# EAGLE design power-bridge (EAGLE 9.5.1)
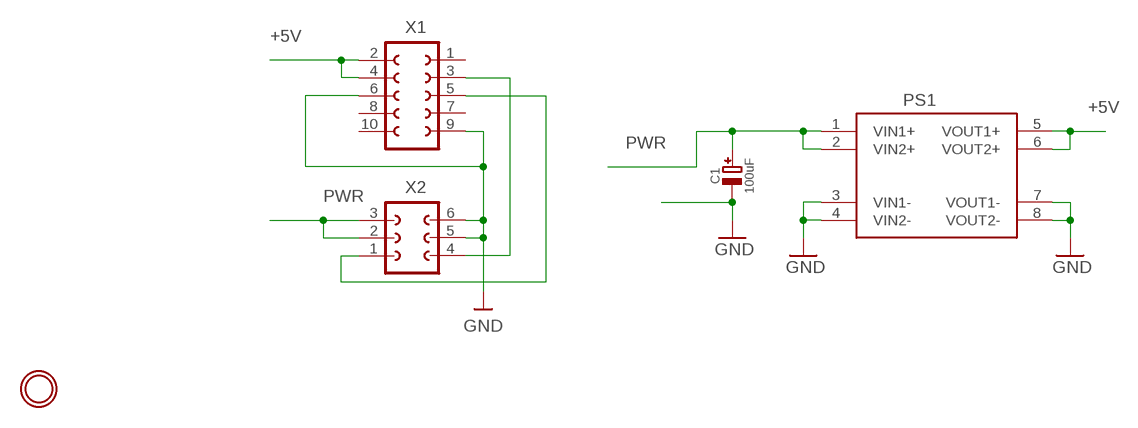
[diagram p0: schematic, sheet 1]

## Parts
C1  100uF  CAP_ELECTROLYTICPTH_3.5MMGRID_8MMDIA  [CELEC_3.5MM_8MM]
PS1  K8801MODULE  [K8801]
U$2  MOUNTINGHOLE2.7_THICK  [MOUNTINGHOLE_2.7_PLATED_THICK]
X1  CON-FE05-2  [FE05-2]
X2  CON-MA03-2PCB_EDGE  [PCB_EDGE_03-2]

## Nets
+5V: PS1.5(VOUT1+) PS1.6(VOUT2+) X1.2 X1.4
GND: C1.- PS1.3(VIN1-) PS1.4(VIN2-) PS1.7(VOUT1-) PS1.8(VOUT2-) X1.6 X1.9 X2.5 X2.6
N$1: X1.3 X2.4
N$2: X1.5 X2.1
PWR: C1.+ PS1.1(VIN1+) PS1.2(VIN2+) X2.2 X2.3
Unconnected: X1.1 X1.7 X1.8 X1.10

## Library data of the parts
C1 = sanisimov:CAP_ELECTROLYTIC: Electrolytic Capacitors SMT PANASONIC_C - Size C Panasonic Electrolytic Aluminum Capacitor 47µF 16V 20% Electrolytic Capacitor [Digikey: PCE3890TR-ND] PANASONIC_D - Size D Panasonic Electrolytic Aluminum Capacitor 100µF 25V 20% Electrolytic Capacitor [Digikey: PCE3898TR-ND] PTH 3.5 mm grid, 8 mm diameter ... 3.5 mm grid, 10 mm diameter ...
PS1 = sanisimov:K8801: 7V-28V to 5V DC-DC Step Down Power Supply Module Voltage Buck Converter 3A Power Supply Board Input voltage:DC 7V-28V Output valtage:DC 5V Output current:3A. max(2A for long time) Working frequency:570KHz Size:22*17.8*5mm
U$2 = sanisimov:MOUNTINGHOLE: Mounting Hole For #2 screws (0.086"/2.18mm width, 0.094"/2.4mm hole) use 2.5mm; BOM: EXCLUDE
X1 = sanisimov:CON-FE05-2: FEMALE HEADER
X2 = sanisimov:CON-MA03-2

## Board
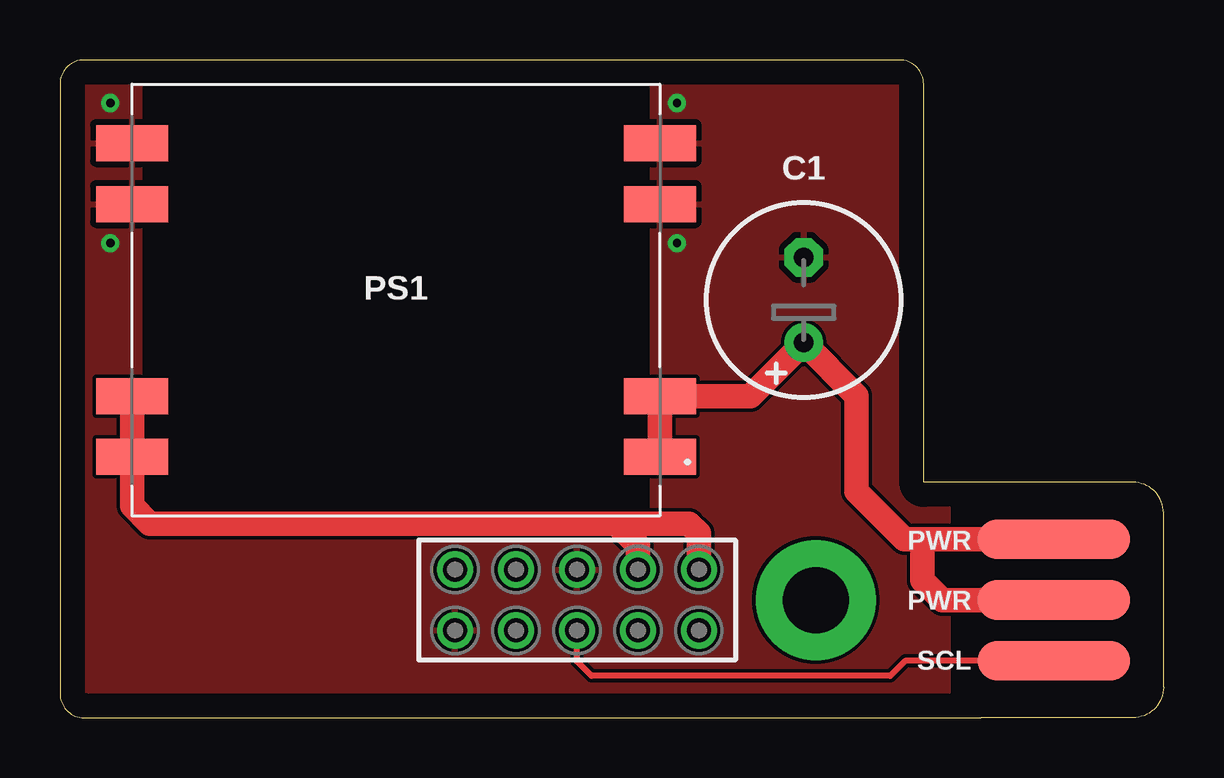
[diagram p1: board, top side]
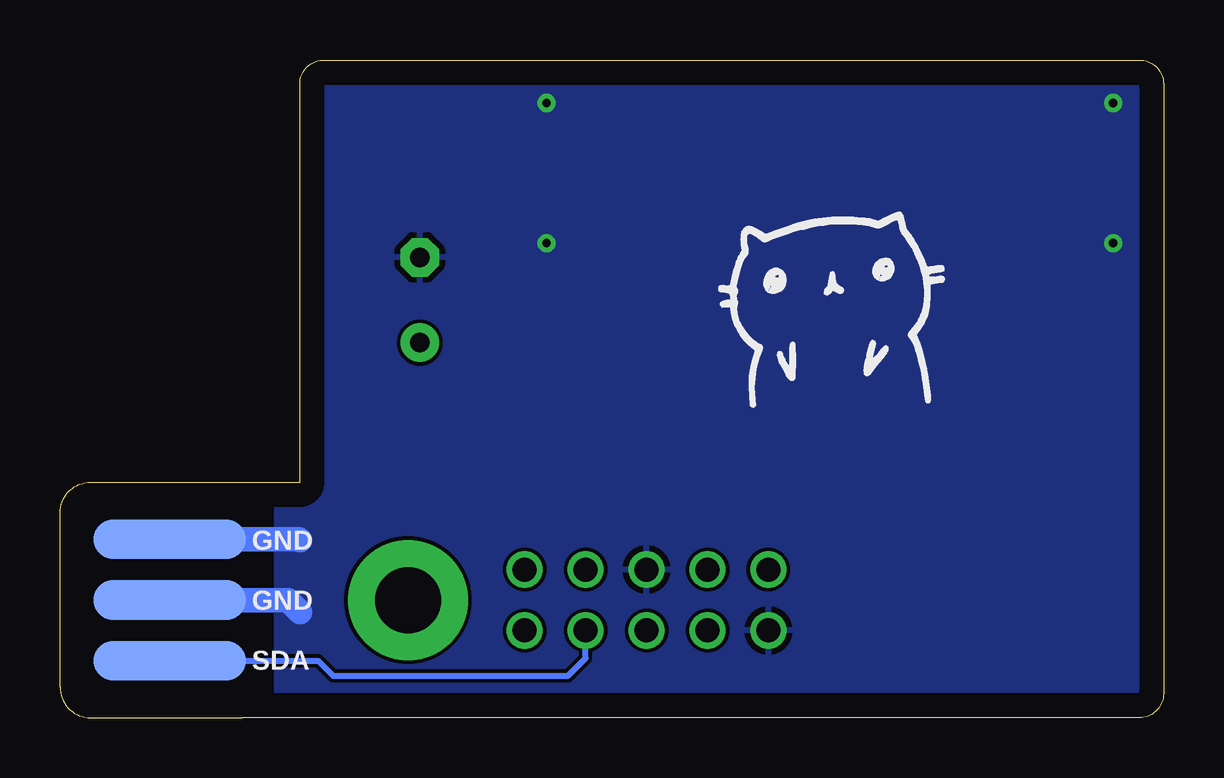
[diagram p2: board, bottom side, seen from below]

Size 46 x 27.4 mm. Coordinates in mm from the lower left corner, seen from the top.
Outline: 38.38,0 1,0 arc-90 0,1 0,26.4 arc-90 1,27.4 35,27.4 arc-90 36,26.4 36,9.8 38.38,9.8
Copper layers (1*16): Top 0.035mm / dielectric 1.5mm / Bottom 0.035mm
Design rules "default *": minimum track width 6mil, minimum drill 0.35mm, track to track 6mil, track to pad 6mil, pad to pad 6mil, via to via 6mil, smd to smd 6mil, copper to edge 40mil, drill to drill 6mil, minimum pad ring 10mil, minimum via ring 8mil, stop-mask expansion 4mil, vias tented up to drill 15mil, thermal gap 10mil

### Footprints (pad centres in the part's own frame; a part is rotated, then mirrored left to right if it is on the bottom)
CELEC_3.5MM_8MM = drill 0.813 pad 1.6: + -1.778,0 | drill 0.813 pad 1.6 octagon: - 1.778,0
K8801 = smd 1.5 x 3: 1 -6.54,-11; 2 -4,-11; 3 4,-11; 4 6.54,-11; 5 -6.54,11; 6 -4,11; 7 4,11; 8 6.54,11
MOUNTINGHOLE_2.7_PLATED_THICK = drill 2.75 pad 5: P$1 0,0
FE05-2 = drill 1: 1 -5.08,1.27; 2 -5.08,-1.27; 3 -2.54,1.27; 4 -2.54,-1.27; 5 0,1.27; 6 0,-1.27; 7 2.54,1.27; 8 2.54,-1.27; 9 5.08,1.27; 10 5.08,-1.27
PCB_EDGE_03-2 = smd 1.651 x 6.35: 1 -2.54,4.572; 2 0,4.572; 3 2.54,4.572 | smd 1.651 x 6.35 bottom: 4 -2.54,4.572; 5 0,4.572; 6 2.54,4.572

### Placement (x,y rotation side)
C1  31,17.4 90 top
PS1  14,17.4 90 top
U$2  31.5,4.9 270 top
U$3  [CAT_LOGO]  13.5,16.4 0 bottom
X1  21.55,4.9 180 top
X2  46,4.9 90 top

### Tracks (layer width: path | path; a pad name or v marks a point on that pad's centre or on a via)
+5V
  Top 1.016: 23.18,8.09 3.74,8.09 3,8.83 PS1.5 PS1.6 | 23.18,8.09 26.23,8.09 26.63,7.68 X1.2 | 23.18,8.09 24.09,7.17 X1.4
GND  (via drill 0.35)
  Bottom 1.016: X2.6 36.04,7.44 36,7.4 | X2.5 36.5,4.9 36,4.4
  other vias: 2.1,25.61 2.1,19.77 25.72,25.61 25.72,19.77
  pour Top: -1,28.4 37,28.4 37,-1.6 -1,-1.6
  pour Bottom: -1,28.4 37,28.4 37,-1.6 -1,-1.6
  cutout Top: 3.5,26.4 24.5,26.4 24.5,8.4 3.5,8.4
N$1
  Bottom 0.254: X2.4 35.23,2.36 34.61,1.74 24.83,1.74 24.09,2.48 X1.3
N$2
  Top 0.254: X2.1 35.23,2.36 34.61,1.74 22.16,1.74 21.55,2.35 X1.5
PWR
  Top 1.016: PS1.1 PS1.2 28.78,13.4 C1.+ 33.21,13.42 33.21,9.43 35.19,7.44 35.95,7.44 | X2.3 35.95,7.44 | X2.2 36.78,4.9 35.95,5.73 35.95,7.44

### Text on the board
tNames: PWR | PWR | SCL
bNames: GND | GND | SDA